# EAGLE schematic P9-Calculadora (EAGLE 9.6.2)
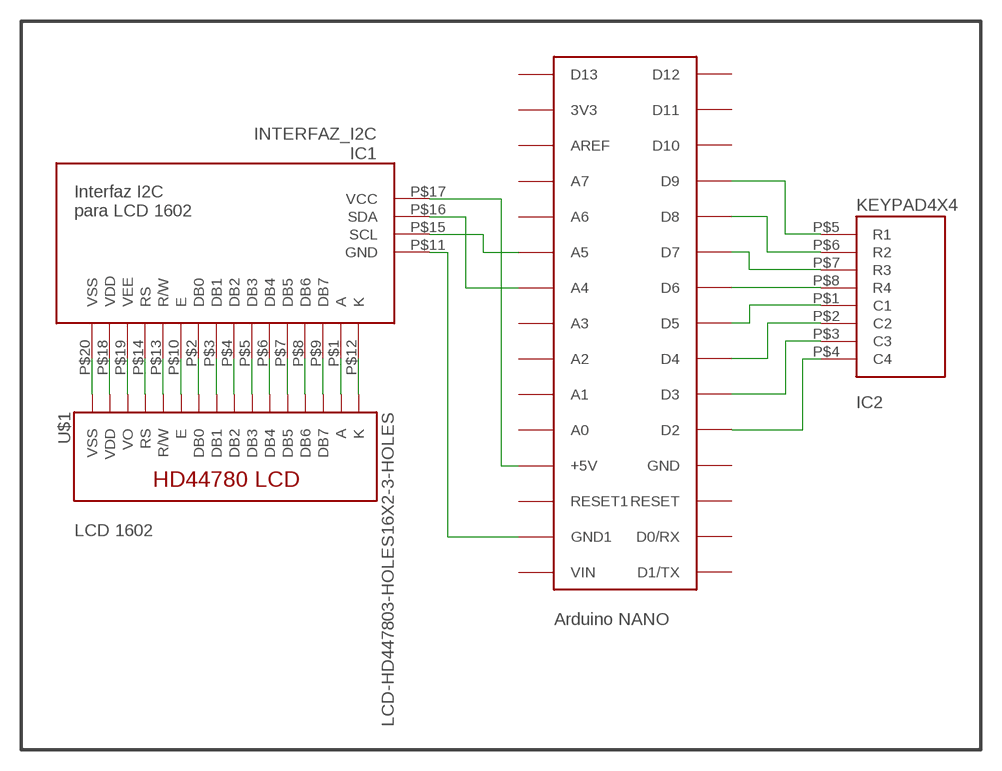
[diagram p0: schematic, sheet 1]

## Parts
IC1  INTERFAZ_I2C  [NO_FOOTPRINT]
IC2  KEYPAD4X4  [NO_FOOTPRINT]
U$1  LCD-HD447803-HOLES16X2-3-HOLES  [LCD-16X2-3HOLES]
U$2  ARDUINONANO  [PDIP-32]

## Nets
N$1: IC1.P$20(VSS) U$1.1(VSS)
N$2: IC1.P$18(VDD) U$1.2(VDD)
N$3: IC1.P$19(VEE) U$1.3(VO)
N$4: IC1.P$14(RS) U$1.4(RS)
N$5: IC1.P$13(R/W) U$1.5(R/W)
N$6: IC1.P$10(E) U$1.6(E)
N$7: IC1.P$2(DB0) U$1.7(DB0)
N$8: IC1.P$3(DB1) U$1.8(DB1)
N$9: IC1.P$4(DB2) U$1.9(DB2)
N$10: IC1.P$5(DB3) U$1.10(DB3)
N$11: IC1.P$6(DB4) U$1.11(DB4)
N$12: IC1.P$7(DB5) U$1.12(DB5)
N$13: IC1.P$8(DB6) U$1.13(DB6)
N$14: IC1.P$9(DB7) U$1.14(DB7)
N$15: IC1.P$12(K) U$1.16(K)
N$16: IC1.P$1(A) U$1.15(A)
N$17: IC2.P$4(C4) U$2.D2
N$18: IC2.P$3(C3) U$2.D3
N$19: IC2.P$2(C2) U$2.D4
N$20: IC2.P$1(C1) U$2.D5
N$21: IC2.P$8(R4) U$2.D6
N$22: IC2.P$7(R3) U$2.D7
N$23: IC2.P$6(R2) U$2.D8
N$24: IC2.P$5(R1) U$2.D9
N$25: IC1.P$16(SDA) U$2.A4
N$26: IC1.P$15(SCL) U$2.A5
N$27: IC1.P$11(GND) U$2.GND1
N$28: IC1.P$17(VCC) U$2.+5V
Unconnected: U$2.3V3 U$2.A0 U$2.A1 U$2.A2 U$2.A3 U$2.A6 U$2.A7 U$2.AREF U$2.D0/RX U$2.D1/TX U$2.D10 U$2.D11 U$2.D12 U$2.D13 U$2.GND U$2.RESET U$2.RESET1 U$2.VIN

## Notes on the sheet
- Interfaz I2C
  para LCD 1602
- LCD 1602
- Arduino NANO

## Library data of the parts
IC1 = Interfaz_I2C:INTERFAZ_I2C
IC2 = keypad_4x4:KEYPAD4X4
U$1 = HD44780LCD:LCD-HD44780
U$2 = jet-lib:ARDUINONANO